# EAGLE design KieserTrainer (EAGLE 6.5.0)
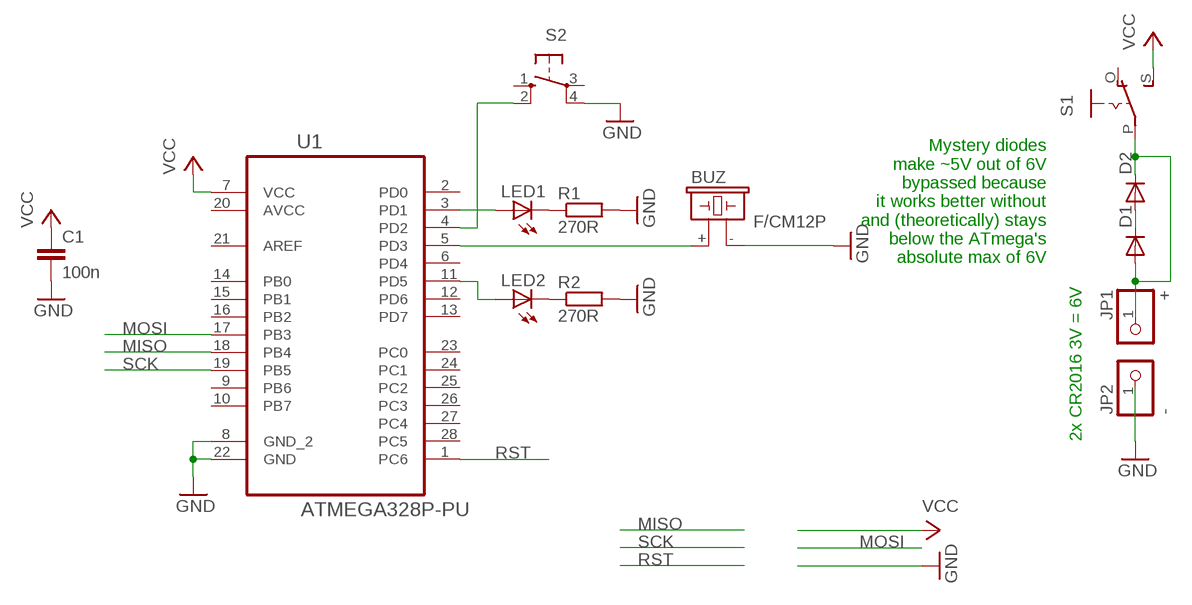
[diagram p0: schematic, sheet 1]

## Parts
BUZ  F/CM12P  [F/CM12P]
C1  100n  C-EUC0805  [C0805]
D1  DIODE-D-7.5  [D-7.5]
D2  DIODE-D-7.5  [D-7.5]
JP1  +  PINHD-1X1  [1X01]
JP2  -  PINHD-1X1  [1X01]
LED1  LED3MM  [LED3MM]
LED2  LED3MM  [LED3MM]
R1  270R  R-EU_R0805  [R0805]
R2  270R  R-EU_R0805  [R0805]
S1  EG1218S  [EG1218]
S2  10-XX  [B3F-10XX]
U1  ATMEGA328P-PU  [DIP254P762X457-28]

## Nets
GND: BUZ.- C1.2 JP2.1 R1.2 R2.2 S2.4(P1) U1.8(GND_2) U1.22(GND)
MISO: U1.18(PB4)
MOSI: U1.17(PB3)
N$1: LED1.K(C) R1.1
N$2: LED2.K(C) R2.1
N$3: LED1.A U1.3(PD1)
N$4: LED2.A U1.11(PD5)
N$5: BUZ.+ U1.5(PD3)
N$6: D1.A D2.C JP1.1 S1.P
N$7: S2.2(S1) U1.4(PD2)
N$8: D1.C D2.A
RST: U1.1(PC6)
SCK: U1.19(PB5)
VCC: C1.1 S1.S U1.7(VCC)
Unconnected: S1.O S2.1(S) S2.3(P) U1.2(PD0) U1.6(PD4) U1.9(PB6) U1.10(PB7) U1.12(PD6) U1.13(PD7) U1.14(PB0) U1.15(PB1) U1.16(PB2) U1.21(AREF) U1.23(PC0) U1.24(PC1) U1.25(PC2) U1.26(PC3) U1.27(PC4) U1.28(PC5)

## Notes on the sheet
- Mystery diodes
  make ~5V out of 6V
  bypassed because
  it works better without
  and (theoretically) stays
  below the ATmega's
  absolute max of 6V
- 2x CR2016 3V = 6V

## Power pins joined to a net without a drawn wire
AVCC: U1.20(AVCC)

## Library data of the parts
BUZ = buzzer:F/CM12P: BUZZER Source: Buerklin; OC_FARNELL: unknown; OC_NEWARK: unknown
C1 = rcl:C-EU: CAPACITOR, European symbol
D1 D2 = diode:DIODE-: DIODE
JP1 JP2 = pinhead:PINHD-1X1: PIN HEADER
LED1 LED2 = led:LED: LED OSRAM: - CHIPLED LG R971, LG N971, LY N971, LG Q971, LY Q971, LO R971, LY R971 LH N974, LH R974 LS Q976, LO Q976, LY Q976 LO Q996 - Hyper CHIPLED LW Q18S LB Q993, LB Q99A, LB R99A - SideLED LS A670, LO A670, LY A670, LG A670, LP A670 LB A673, LV A673, LT A673, LW A673 LH A674 LY A675 LS A676, LA A676, LO A676, LY A676, LW A676 LS A679, LY A679, LG A679 - Hyper Micro SIDELED® LS Y876, LA Y876, LO Y876, LY Y876 LT Y87S - SmartLED LW L88C, LW L88S LB L89C, LB L89S, LG L890 LS L89K, LO L89K, LY L89K LS L896, LA L896, LO L896, LY L896 - TOPLED LS T670, LO T670, LY T670, LG T670, LP T670 LSG T670, LSP T670, LSY T670, LOP T670, LYG T670 LG T671, LOG T671, LSG T671 LB T673, LV T673, LT T673, LW T673 LH T674 LS T676, LA T676, LO T676, LY T676, LB T676, LH T676, LSB T676, LW T676 LB T67C, LV T67C, LT T67C, LS T67K, LO T67K, LY T67K, LW E67C LS E67B, LA E67B, LO E67B, LY E67B, LB E67C, LV E67C, LT E67C LW T67C LS T679, LY T679, LG T679 LS T770, LO T770, LY T770, LG T770, LP T770 LB T773, LV T773, LT T773, LW T773 LH T774 LS E675, LA E675, LY E675, LS T675 LS T776, LA T776, LO T776, LY T776, LB T776 LHGB T686 LT T68C, LB T68C - Hyper Mini TOPLED® LB M676 - Mini TOPLED Santana® LG M470 LS M47K, LO M47K, LY M47K Source: http://www.osram.convergy.de LUXEON: - LUMILED® LXK2-PW12-R00, LXK2-PW12-S00, LXK2-PW14-U00, LXK2-PW14-V00 LXK2-PM12-R00, LXK2-PM12-S00, LXK2-PM14-U00 LXK2-PE12-Q00, LXK2-PE12-R00, LXK2-PE12-S00, LXK2-PE14-T00, LXK2-PE14-U00 LXK2-PB12-K00, LXK2-PB12-L00, LXK2-PB12-M00, LXK2-PB14-N00, LXK2-PB14-P00, LXK2-PB14-Q00 LXK2-PR12-L00, LXK2-PR12-M00, LXK2-PR14-Q00, LXK2-PR14-R00 LXK2-PD12-Q00, LXK2-PD12-R00, LXK2-PD12-S00 LXK2-PH12-R00, LXK2-PH12-S00 LXK2-PL12-P00, LXK2-PL12-Q00, LXK2-PL12-R00 Source: www.luxeon.com KINGBRIGHT: KA-3528ASYC Source: www.kingbright.com
R1 R2 = rcl:R-EU_: RESISTOR, European symbol
S1 = adafruit:EG1218: SLIDING SWITCH 0.1" spacing through hole, vertical SPDT slide switch http://www.ladyada.net/library/pcb/eaglelibrary.html
S2 = switch-omron:10-XX: OMRON SWITCH; MPN: B3F-1000; OC_FARNELL: 176432; OC_NEWARK: 36M3542
U1 = Atmel_By_element14_Batch_1-00:ATMEGA328P-PU: 8-bit Microcontroller with In-System Programmable Flash; MPN: ATMEGA328P-PU; OC_FARNELL: 1715487; OC_NEWARK: 15R0268; PACKAGE: PDIP-28; SUPPLIER: Atmel

## Board
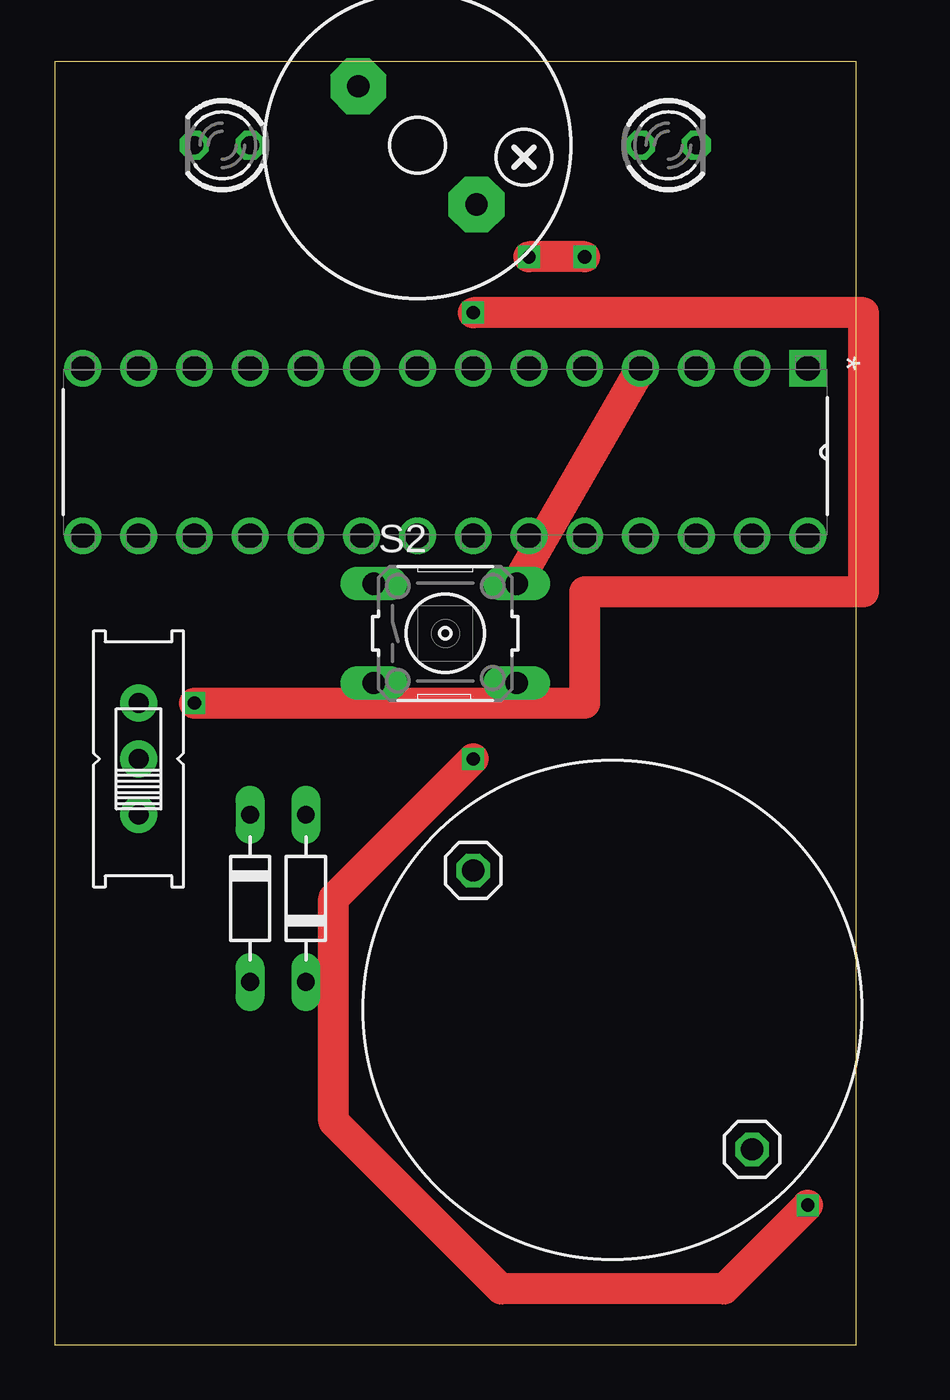
[diagram p1: board, top side]
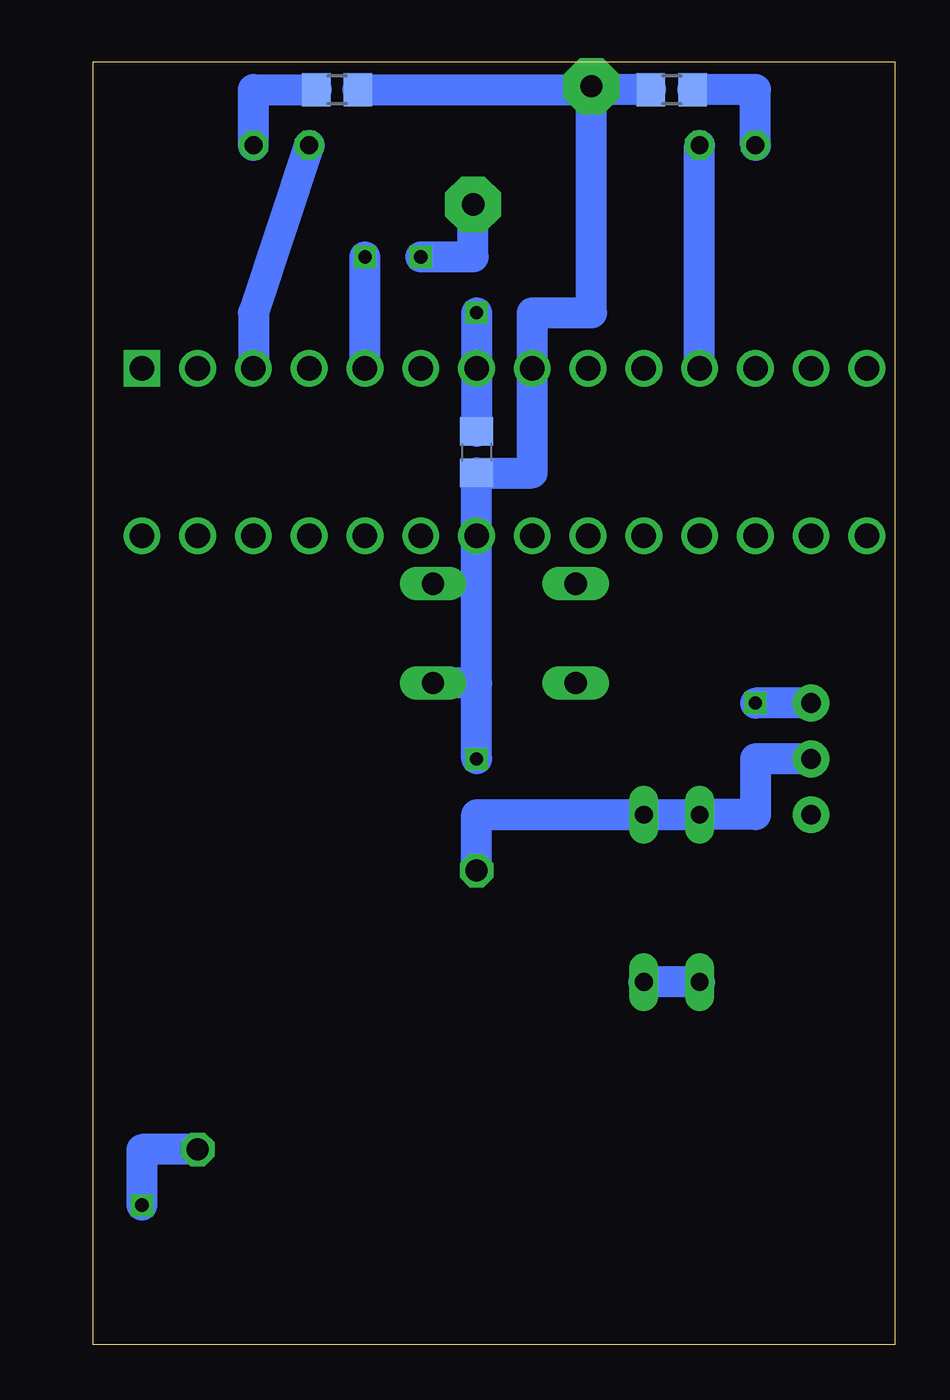
[diagram p2: board, bottom side, seen from below]

Size 36.5 x 58.41 mm. Coordinates in mm from the lower left corner, seen from the top.
Outline: 0,0 36.5,0 36.5,58.41 0,58.41 0,0
Copper layers (1*16): Top 0.035mm / dielectric 1.5mm / Bottom 0.035mm
Design rules "default": minimum track width 10mil, minimum drill 24mil, track to track 8mil, track to pad 8mil, pad to pad 8mil, via to via 8mil, smd to smd 8mil, copper to edge 40mil, drill to drill 8mil, minimum pad ring 10mil, minimum via ring 8mil, stop-mask expansion 4mil, vias tented up to drill 0mil, thermal gap 10mil

### Footprints (pad centres in the part's own frame; a part is rotated, then mirrored left to right if it is on the bottom)
F/CM12P = drill 1.016 pad 2.54 octagon: + 3.81,0; - -3.81,0
C0805 = smd 1.3 x 1.5: 1 -0.95,0; 2 0.95,0
D-7.5 = drill 0.813 long: A 3.81,0; C -3.81,0
1X01 = drill 1.016 octagon: 1 0,0
LED3MM = drill 0.813 octagon: A -1.27,0; K 1.27,0
R0805 = smd 1.3 x 1.5: 1 -0.95,0; 2 0.95,0
EG1218 = drill 0.9 pad 1.676: O -2.54,0; P 0,0; S 2.54,0
B3F-10XX = drill 1.016 long: 1 -3.251,2.261; 2 3.251,2.261; 3 -3.251,-2.261; 4 3.251,-2.261
DIP254P762X457-28 = drill 1.118 square: 1 -7.62,33.02 | drill 1.118: 2 -7.62,30.48; 3 -7.62,27.94; 4 -7.62,25.4; 5 -7.62,22.86; 6 -7.62,20.32; 7 -7.62,17.78; 8 -7.62,15.24; 9 -7.62,12.7; 10 -7.62,10.16; 11 -7.62,7.62; 12 -7.62,5.08; 13 -7.62,2.54; 14 -7.62,0; 15 0,0; 16 0,2.54; 17 0,5.08; 18 0,7.62; 19 0,10.16; 20 0,12.7; 21 0,15.24; 22 0,17.78; 23 0,20.32; 24 0,22.86; 25 0,25.4; 26 0,27.94; 27 0,30.48; 28 0,33.02

### Placement (x,y rotation side)
BUZ  16.51,54.61 315 top
C1  19.05,40.64 270 bottom
D1  11.43,20.32 90 top
D2  8.89,20.32 270 top
JP1  19.05,21.59 0 top
JP2  31.75,8.89 0 top
LED1  27.94,54.61 0 top
LED2  7.62,54.61 180 top
R1  25.4,57.15 0 bottom
R2  10.16,57.15 180 bottom
S1  3.81,26.67 90 top
S2  17.78,32.38 0 top
U1  1.27,36.83 270 top

### Tracks (layer width: path | path; a pad name or v marks a point on that pad's centre or on a via)
GND  (via drill 0.6)
  Top 1.422: v34.29,6.35 30.48,2.54 20.32,2.54 12.7,10.16 12.7,20.32 v19.05,26.67
  Bottom 1.422: R2.2 13.82,57.15 | R1.2 13.82,57.15 | 13.82,57.15 BUZ.- 13.82,46.99 16.51,46.99 U1.8 16.51,39.69 C1.2 U1.22 19.05,30.12 | JP2.1 34.29,8.89 v34.29,6.35 | v19.05,26.67 19.05,30.12 | 19.05,30.12 S2.4
N$1
  Bottom 1.422: LED1.K 29.21,57.15 R1.1
N$2
  Bottom 1.422: LED2.K 6.35,57.15 R2.1
N$3
  Bottom 1.422: LED1.A 29.21,46.99 U1.3
N$4
  Bottom 1.422: U1.11 LED2.A
N$5  (via drill 0.6)
  Top 1.422: v24.13,49.53 v21.59,49.53
  Bottom 1.422: U1.5 v24.13,49.53 | v21.59,49.53 19.2,49.53 BUZ.+
N$6
  Bottom 1.422: JP1.1 19.05,24.13 D1.A D2.C 6.35,24.13 6.35,26.67 S1.P
N$7
  Top 1.422: U1.4 S2.2
N$8
  Bottom 1.422: D2.A D1.C
VCC  (via drill 0.6)
  Top 1.422: v6.35,29.21 24.13,29.21 24.13,34.29 36.83,34.29 36.83,46.99 v19.05,46.99
  Bottom 1.422: S1.S v6.35,29.21 | v19.05,46.99 U1.7 C1.1